# EAGLE design cn3302 (EAGLE 9.4.2)
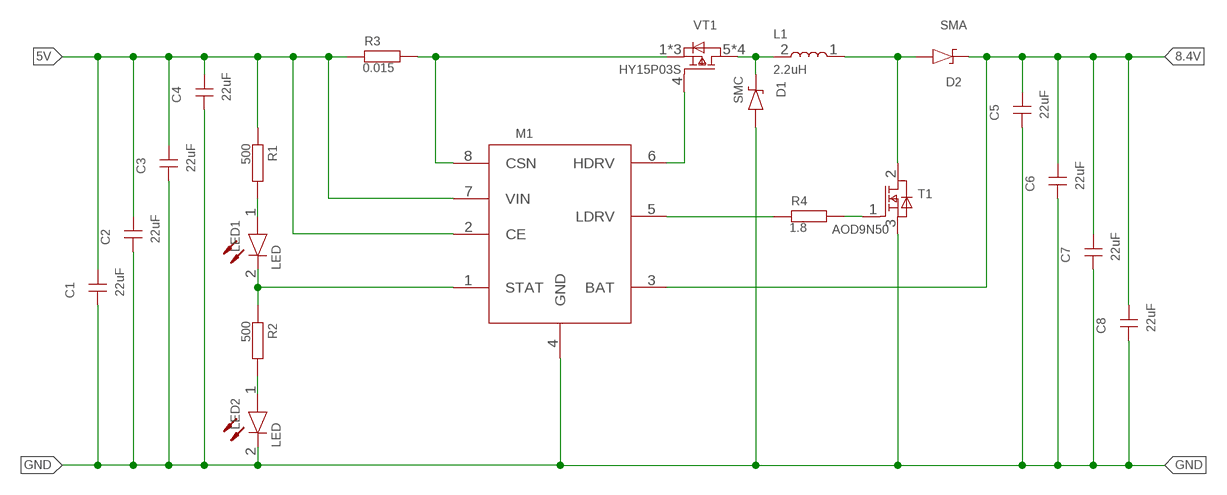
[diagram p0: schematic, sheet 1]

## Parts
C1  22uF  CAPACITOR  [1206]
C2  22uF  CAPACITOR  [1206]
C3  22uF  CAPACITOR  [1206]
C4  22uF  CAPACITOR  [1206]
C5  22uF  CAPACITOR  [1206]
C6  22uF  CAPACITOR  [1206]
C7  22uF  CAPACITOR  [1206]
C8  22uF  CAPACITOR  [1206]
D1  SMC  DIODESSMC  [SMC]
D2  SMA  DIODESSMA  [SMA]
L1  2.2uH  INDUCTORFXL0530-2R2-M  [FXL0530]
LED1  LED  [LED]
LED2  LED  [LED]
M1  CN3302SOP-8  [SOP-8]
R1  500  RESISTOR0603  [0603]
R2  500  RESISTOR0603  [0603]
R3  0.015  RESISTOR2512  [2512]
R4  1.8  RESISTOR0603  [0603]
T1  AOD9N50  AOD9N50  [DRACK]
VT1  HY15P03S  [SOP-8]

## Nets
5V: C1.2 C2.2 C3.2 C4.2 M1.2(CE) M1.7(VIN) R1.1 R3.1
8.4V: C5.2 C6.2 C7.2 C8.2 D2.2(C) M1.3(BAT)
GND: C1.1 C2.1 C3.1 C4.1 C5.1 C6.1 C7.1 C8.1 D1.1(A) LED2.2(CATHODE) M1.4(GND) T1.3(S)
N$1: LED1.1(ANODE) R1.2
N$2: LED2.1(ANODE) R2.2
N$3: M1.6(HDRV) VT1.4(G)
N$4: M1.5(LDRV) R4.1
N$5: LED1.2(CATHODE) M1.1(STAT) R2.1
N$6: M1.8(CSN) R3.2 VT1.1(S) VT1.2(S) VT1.3(S)
N$8: R4.2 T1.1(G)
N$9: D1.2(C) L1.2 VT1.5(D) VT1.6(D) VT1.7(D) VT1.8(D)
N$10: D2.1(A) L1.1 T1.2(D)

## Library data of the parts
C1-C8 = 1_RESISTORS:CAPACITOR
D1 D2 = 1_DIODES:DIODES
L1 = 1_INDUCTOR:INDUCTOR
LED1 LED2 = 1_LED:LED
M1 = 1_MICRO:CN3302
R1-R4 = 1_RESISTORS:RESISTOR
T1 = 1_TRANSISTORS:AOD9N50
VT1 = 1_TRANSISTORS:HY15P03S

## Board
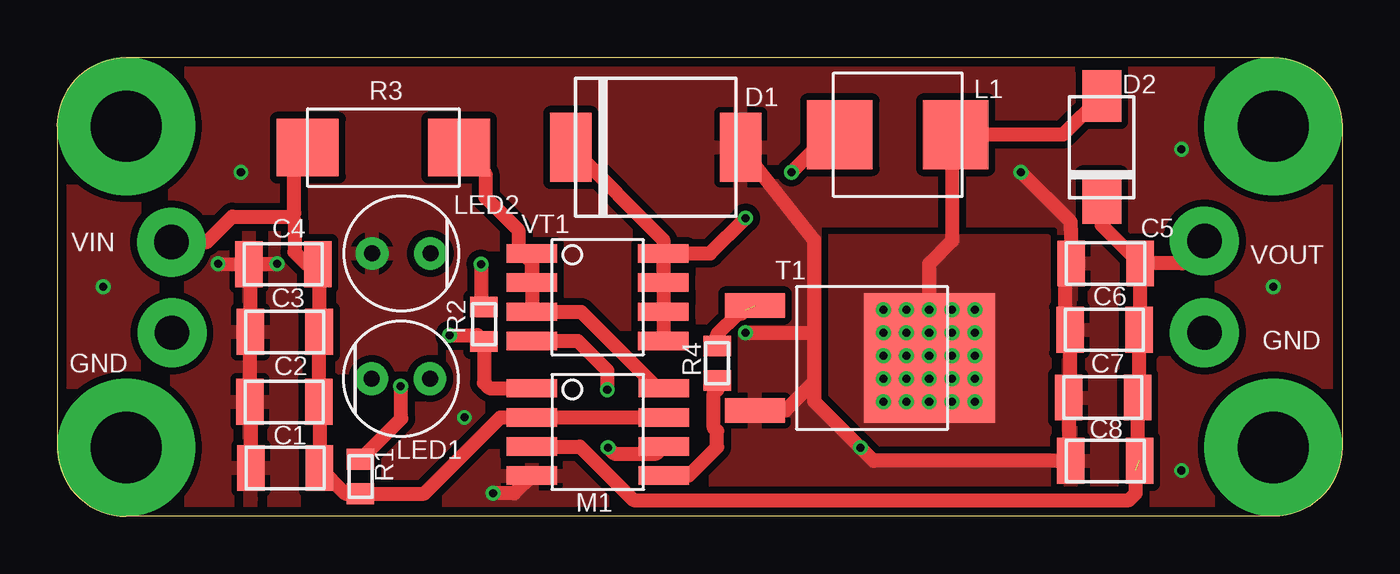
[diagram p1: board, top side]
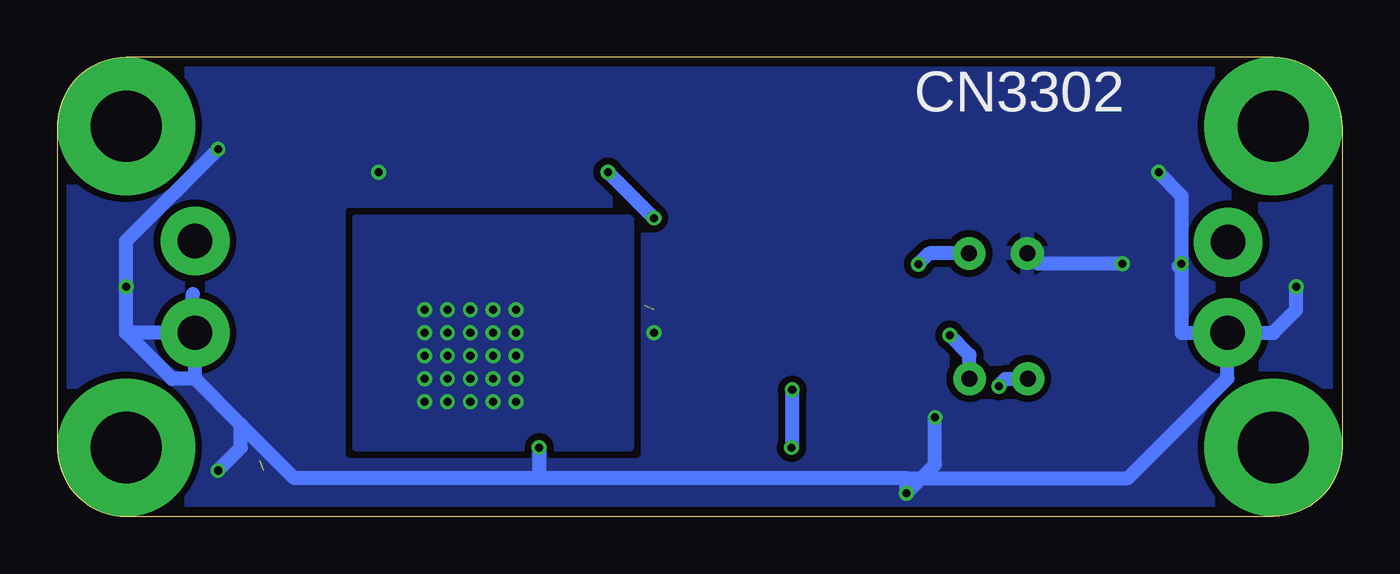
[diagram p2: board, bottom side, seen from below]

Size 56 x 20 mm. Coordinates in mm from the lower left corner, seen from the top.
Outline: 3,20 53,20 arc-90 56,17 56,3 arc-90 53,0 3,0 arc-90 0,3 0,17 arc-90 3,20
Copper layers (1*16): Top 0.035mm / dielectric 1.6mm / Bottom 0.035mm
Design rules "rezonit": minimum track width 0.125mm, minimum drill 0.3mm, track to track 0.125mm, track to pad 0.2mm, pad to pad 0.125mm, via to via 0.2mm, smd to smd 0mil, copper to edge 0.4mm, drill to drill 8mil, minimum pad ring 0.2mm, minimum via ring 0.15mm, stop-mask expansion 0.1mm, vias tented up to drill 3mm, thermal gap 10mil

### Footprints (pad centres in the part's own frame; a part is rotated, then mirrored left to right if it is on the bottom)
1206 = smd 1.2 x 2: 1 -1.5,0; 2 1.5,0
SMC = smd 1.8 x 3: 1 3.7,0; 2 -3.7,0
SMA = smd 2.25 x 1.7: 1 2.225,0; 2 -2.225,0
FXL0530 = smd 2.85 x 3: 1 2.525,0; 2 -2.525,0
LED = drill 0.7 pad 1.422: 1 1.27,0; 2 -1.27,0
SOP-8 = smd 0.8 x 2.2: 1 -1.905,-2.87; 2 -0.635,-2.87; 3 0.635,-2.87; 4 1.905,-2.87; 5 1.905,2.87; 6 0.635,2.87; 7 -0.635,2.87; 8 -1.905,2.87
0603 = smd 0.9 x 1.2: 1 -0.75,0; 2 0.75,0
2512 = smd 2.7 x 2.5: 1 -3.3,0; 2 3.3,0
DRACK = smd 2.6 x 1.06: 1 5.1,-2.286; 3 5.1,2.286 | smd 5.7 x 5.632: 2 -2.5,0

### Placement (x,y rotation side)
C1  9.93,2.11 0 top
C2  9.89,4.99 0 top
C3  9.91,8.04 0 top
C4  9.85,10.99 0 top
C5  45.69,11.02 0 top
C6  45.64,8.13 0 top
C7  45.58,5.18 0 top
C8  45.67,2.42 0 top
D1  26.08,16.08 0 top
D2  45.52,16.09 90 top
L1  36.63,16.63 0 top
LED1  14.97,6 180 top
LED2  14.99,11.46 0 top
M1  23.56,3.68 270 top
R1  13.21,1.74 90 top
R2  18.59,8.37 90 top
R3  14.21,16.07 0 top
R4  28.76,6.67 90 top
T1  35.51,6.9 180 top
VT1  23.55,9.55 270 top

### Tracks (layer width: path | path; a pad name or v marks a point on that pad's centre or on a via)
5V  (via drill 1.5 pad 3)
  Top 0.61: C4.2 11.41,10.93 C3.2 11.39,8.02 C2.2 11.43,4.95 C1.2 12.55,0.99 R1.1 15.99,0.99 19.32,4.32 M1.2 M1.7 | R3.1 10.33,15.49 10.33,13.21 10.18,13.06 | C4.2 10.86,10.99 10.34,11.51 10.34,12.9 10.18,13.06 | C4.2 11.44,11.08 | v4.97,11.95 6.51,11.95 7.62,13.06 10.18,13.06
8.4V  (via drill 1.5 pad 3)  (1 unrouted)
  Top 0.61: C5.2 47.06,10.89 47.06,10.7 | 47.13,5.23 C7.2 | C7.2 47.08,5.11 | 46.87,4.9 47.08,5.11 | 47.08,5.11 47.14,5.17 C6.2 47.19,8.18 C5.2 | 47.14,2.45 C8.2 47.08,2.51 C7.2 | v50,12 49.02,11.02 C5.2 | C5.2 45.52,12.69 D2.2 | M1.3 22.78,3.04 25.12,0.71 46.7,0.71 47,1 47,2
GND  (via drill 0.35)
  Top 0.61: C4.1 | C4.1 8.41,10.93 C3.1 8.39,8.02 C2.1 8.43,4.95 C1.1 | C1.1 8.43,1.87 | C6.1 43.94,8.33 43.94,10.29 43.97,10.32 | C6.1 44.14,5.24 C7.1 44.08,2.51 C8.1 35.58,2.42 v35,3 32.98,5.01 32.98,5.86 | C1.1 8.43,2.34 | D1.1 32.98,12.04 32.98,8 | 32.98,8 32.98,5.86 | 32.98,5.86 31.74,4.61 T1.3 | 44.19,8.08 C6.1 | C4.1 8.37,11.01 v9.57,11.01 | v7,11 C4.1 | 43.97,10.32 44.19,10.54 C5.1 44.19,12.51 44.16,12.53 44.16,12.84 v42,15 | 43.97,10.32 44,10.35 | v30,8 32.98,8 | M1.4 19.91,1 v19,1
  Bottom 0.61: 19,1.67 35,1.67 | 35,1.67 45.67,1.67 48,4 | 50.1,9.69 50.1,8.01 50.09,8 | v8,15 8,14.97 7,13.97 v7,11 | v7,11 7.12,10.88 | v9.57,11.01 13.27,11.01 LED2.2 | 19,1.67 v19,1 17.74,2.26 v17.74,4.31 | 48,4 49.99,6 | v35,3 35,1.67 | 49.99,6 49.99,7.9 50.09,8 | 53,8 50.99,6 49.99,6 | 50.09,8 53,8 | 53,8 v53,10 53,12 v49,16 | v49,2 48,3 48,4 | v7,11 7,8 5,8 | 5,8 3,8 2,9 v2,10 | 5,8 5,6 9.33,1.67 19,1.67
  pour Top (isolate 0.3, rank 2): 56,20 0,20 0,0 56,0
  pour Bottom (isolate 0.3, rank 2): -1,-1 -1,21 57,21 57,-1
N$1  (via drill 0.35)
  Top 0.61: v14.96,5.67 14.98,5.67 14.98,4.26 R1.2
  Bottom 0.61: v14.96,5.67 14.96,5.71 14.68,5.99 LED1.1
N$2  (via drill 0.35)
  Top 0.61: v18.46,10.99 18.46,9.24 R2.2
  Bottom 0.61: LED2.1 18.01,11.46 v18.47,11 v18.46,10.99
N$3  (via drill 0.35)
  Top 0.61: 26.41,3.06 M1.6 26.11,2.73 24.27,2.73 v24,3 | VT1.4 22.68,7.64 23.97,6.36 v23.97,5.51
  Bottom 0.61: v23.97,5.51 23.97,3.03 v24,3
N$4
  Top 0.61: M1.5 27.52,1.77 28.76,3.02 28.76,3.72 28.61,3.88 28.61,5.35 28.76,5.51 R4.1
N$5  (via drill 0.35)
  Top 0.61: M1.1 18.82,5.58 18.59,5.82 R2.1 18.32,7.89 v17.11,7.89
  Bottom 0.61: LED1.2 16.24,7.03 v17.11,7.89
N$6
  Top 0.61: VT1.1 VT1.2 | VT1.2 VT1.3 22.83,8.91 26.16,5.58 M1.8 | R3.2 18.66,14.92 18.66,13.9 20.1,12.46 20.1,11.64 | 20.1,11.64 20.14,11.68 | VT1.2 20.68,11.06 20.1,11.64
N$7  (via drill 3.1 pad 6)
  other vias: 3,17
N$8  (1 unrouted)
  Top 0.61: 30,9 29.83,8.83 29.66,8.83 28.76,7.93 R4.2
N$9  (via drill 0.35)
  Top 0.61: VT1.8 VT1.7 VT1.6 VT1.5 26.68,7.64 | 26.42,10.72 VT1.8 | D1.2 26.42,12.04 VT1.8 | VT1.8 28.45,11.46 v30,13 | v32,15 33.63,16.63 L1.2
  Bottom 0.61: v30,13 v32,15
N$10  (via drill 0.35)
  Top 0.61: T1.2 38.01,11.01 39,12 39,16.48 L1.1 43.84,16.63 D2.1
  other vias: 40,9 36,9 37,9 38,9 39,9 39,8 39,7 36,8 36,7 37,7 38,7 37,8 40,8 40,7 36,6 37,6 38,6 39,6 40,6 36,5 37,5 38,5 39,5 40,5 38,8
  pour Top (isolate 0.3, no thermals): 31,12.16 43.17,12.16 43.17,3 31,3
  pour Bottom (isolate 0.3): 31,13 43,13 43,3 31,3
N$11  (via drill 3.1 pad 6)
  other vias: 3,3
N$12  (via drill 3.1 pad 6)
  other vias: 53,3
N$13  (via drill 3.1 pad 6)
  other vias: 53,17
N$14  (via drill 1.5 pad 3)
  other vias: 50,8
N$15  (via drill 1.5 pad 3)
  other vias: 5,8

### Text on the board
tPlace: VIN | GND | GND
tNames: VOUT
bNames: CN3302